# EAGLE design rf231con (EAGLE 6.5.0)
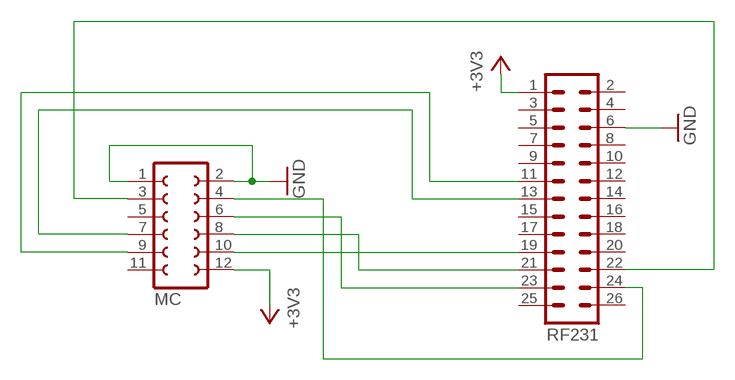
[diagram p0: schematic, sheet 1]

## Parts
MC  FE06-2  [FE06-2]
RF231  MA13-2  [MA13-2]

## Nets
+3V3: MC.12 RF231.1
GND: MC.1 MC.2 RF231.6
N$1: MC.4 RF231.24
N$2: MC.6 RF231.23
N$3: MC.8 RF231.21
N$4: MC.10 RF231.19
N$5: MC.9 RF231.11
N$6: MC.7 RF231.13
N$7: MC.3 RF231.22
Unconnected: MC.5 MC.11 RF231.2 RF231.3 RF231.4 RF231.5 RF231.7 RF231.8 RF231.9 RF231.10 RF231.12 RF231.14 RF231.15 RF231.16 RF231.17 RF231.18 RF231.20 RF231.25 RF231.26

## Library data of the parts
MC = con-lsta:FE06-2: FEMALE HEADER; OC_FARNELL: unknown; OC_NEWARK: unknown
RF231 = con-lstb:MA13-2: PIN HEADER; OC_FARNELL: unknown; OC_NEWARK: unknown

## Board
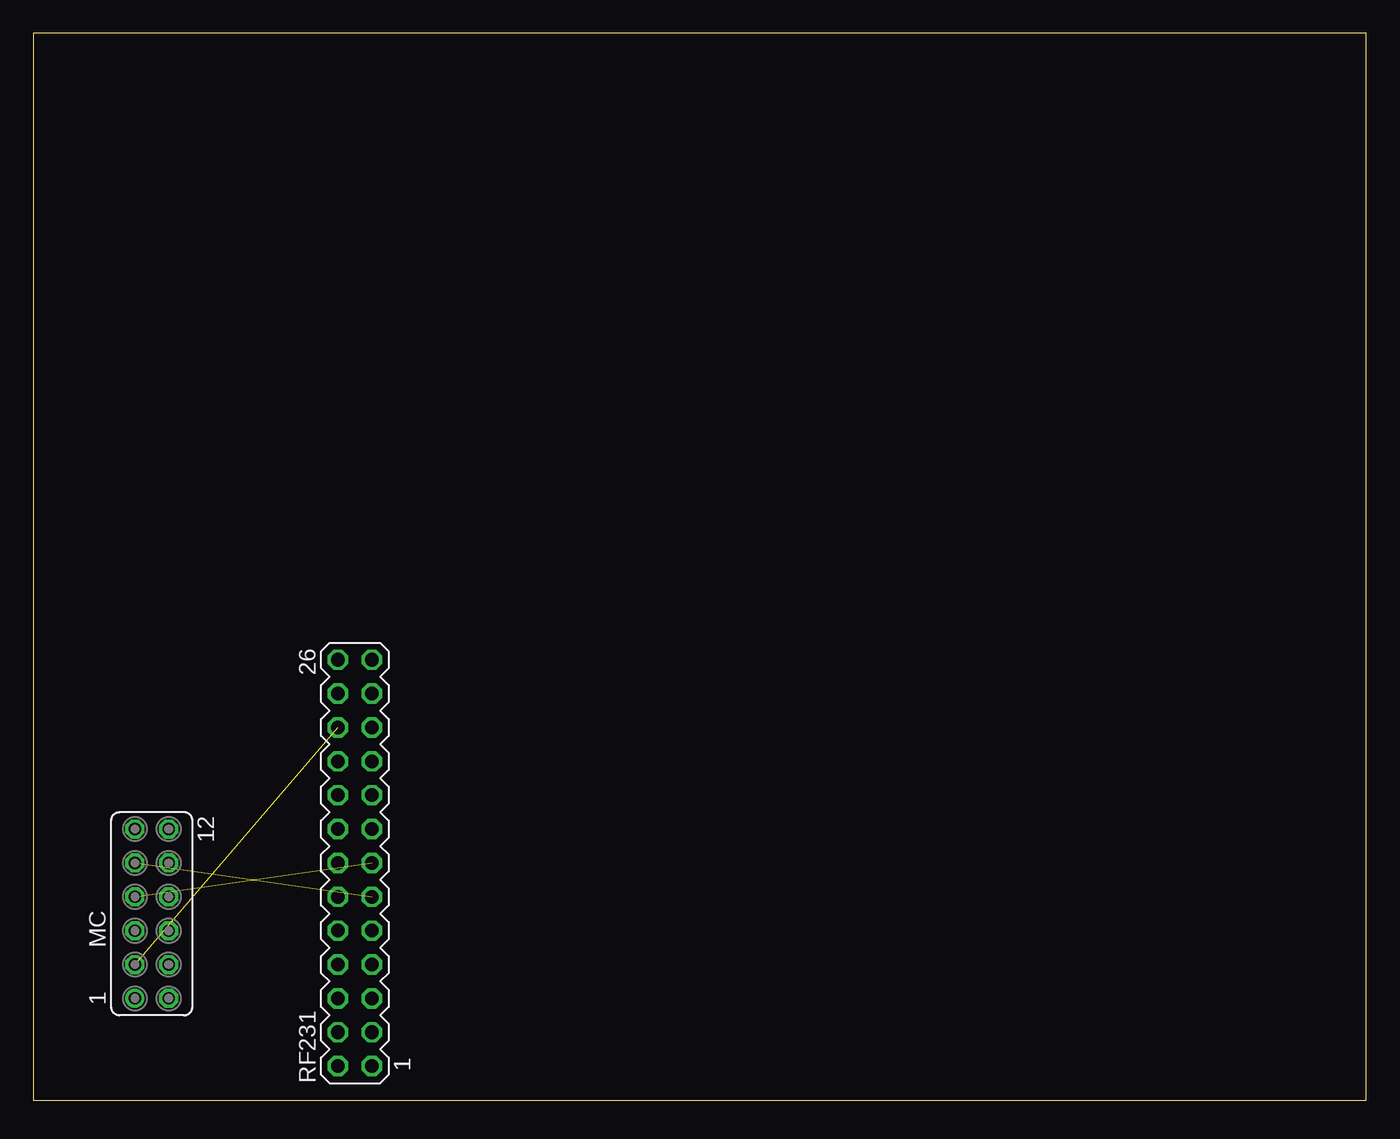
[diagram p1: board, top side]
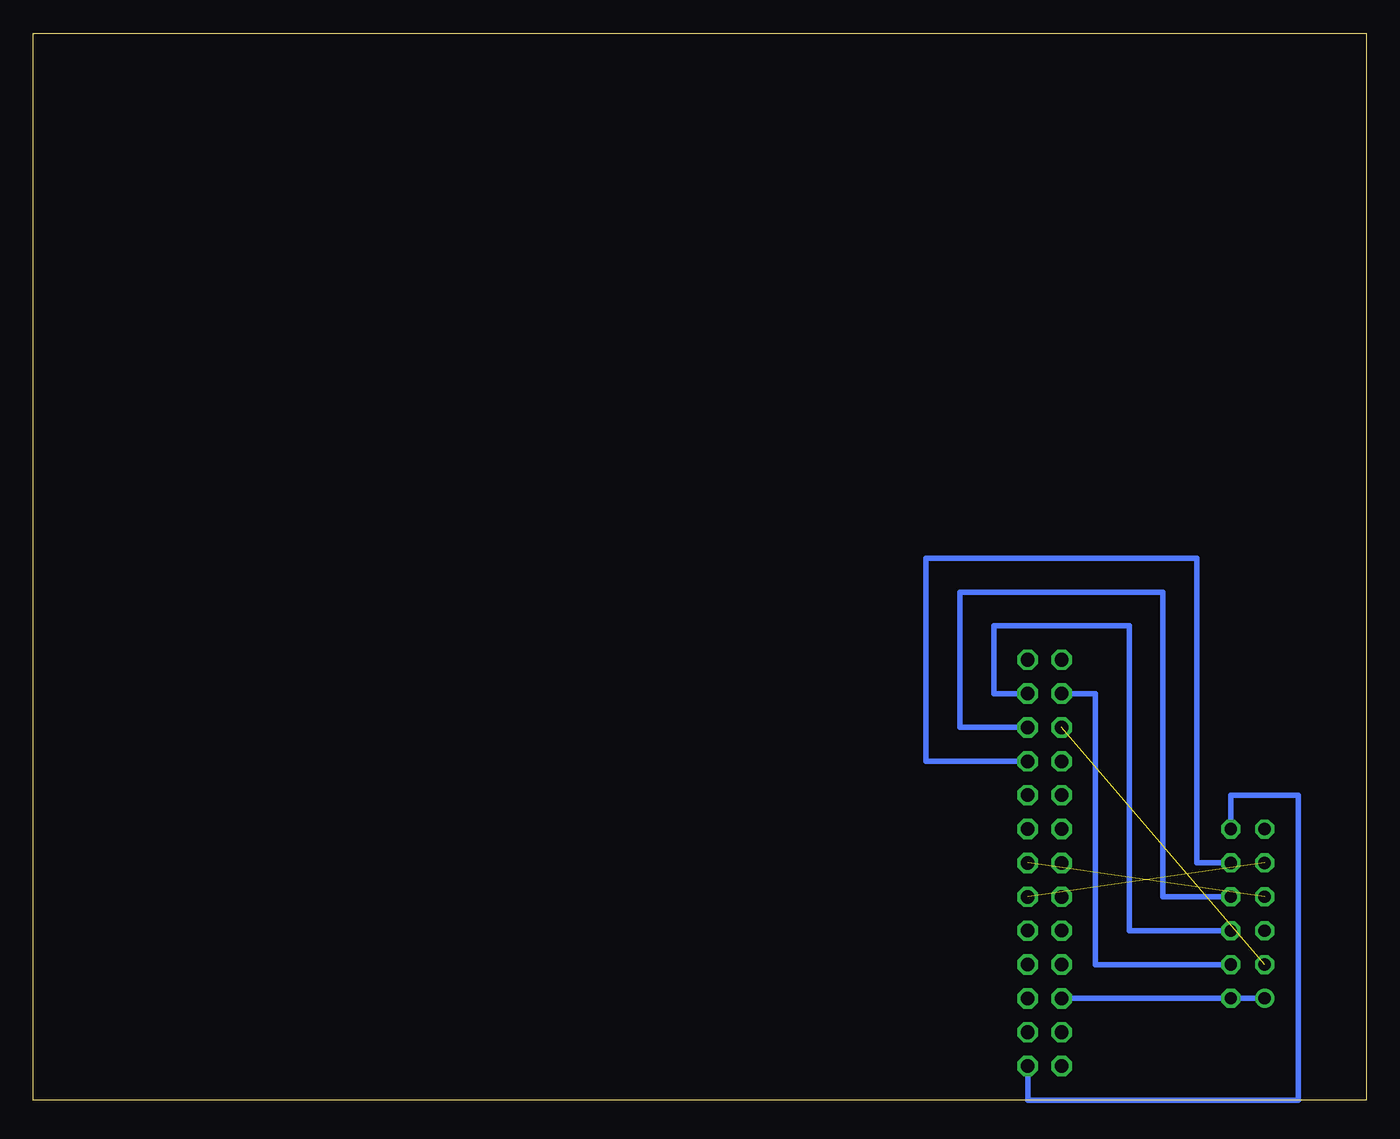
[diagram p2: board, bottom side, seen from below]

Size 100 x 80 mm. Coordinates in mm from the lower left corner, seen from the top.
Outline: 0,0 100,0 100,80 0,80 0,0
Copper layers (1*16): Top 0.035mm / dielectric 1.5mm / Bottom 0.035mm
Design rules "default": minimum track width 10mil, minimum drill 24mil, track to track 8mil, track to pad 8mil, pad to pad 8mil, via to via 8mil, smd to smd 8mil, copper to edge 40mil, drill to drill 8mil, minimum pad ring 10mil, minimum via ring 8mil, stop-mask expansion 4mil, vias tented up to drill 0mil, thermal gap 10mil

### Footprints (pad centres in the part's own frame; a part is rotated, then mirrored left to right if it is on the bottom)
FE06-2 = drill 0.914: 1 -6.35,1.27 | drill 0.914 octagon: 2 -6.35,-1.27; 3 -3.81,1.27; 4 -3.81,-1.27; 5 -1.27,1.27; 6 -1.27,-1.27; 7 1.27,1.27; 8 1.27,-1.27; 9 3.81,1.27; 10 3.81,-1.27; 11 6.35,1.27; 12 6.35,-1.27
MA13-2 = drill 1.016 octagon: 1 -15.24,-1.27; 2 -15.24,1.27; 3 -12.7,-1.27; 4 -12.7,1.27; 5 -10.16,-1.27; 6 -10.16,1.27; 7 -7.62,-1.27; 8 -7.62,1.27; 9 -5.08,-1.27; 10 -5.08,1.27; 11 -2.54,-1.27; 12 -2.54,1.27; 13 0,-1.27; 14 0,1.27; 15 2.54,-1.27; 16 2.54,1.27; 17 5.08,-1.27; 18 5.08,1.27; 19 7.62,-1.27; 20 7.62,1.27; 21 10.16,-1.27; 22 10.16,1.27; 23 12.7,-1.27; 24 12.7,1.27; 25 15.24,-1.27; 26 15.24,1.27

### Placement (x,y rotation side)
MC  8.89,13.97 90 top
RF231  24.13,17.78 90 top

### Tracks (layer width: path | path; a pad name or v marks a point on that pad's centre or on a via)
+3V3
  Bottom 0.406: MC.12 10.16,22.86 5.08,22.86 5.08,0 25.4,0 RF231.1
GND
  Bottom 0.406: MC.1 MC.2 RF231.6
N$1
  Bottom 0.406: MC.4 20.32,10.16 20.32,30.48 RF231.24
N$2
  Bottom 0.406: MC.6 17.78,12.7 17.78,35.56 27.94,35.56 27.94,30.48 RF231.23
N$3
  Bottom 0.406: RF231.21 30.48,27.94 30.48,38.1 15.24,38.1 15.24,15.24 MC.8
N$4
  Bottom 0.406: RF231.19 33.02,25.4 33.02,40.64 12.7,40.64 12.7,17.78 MC.10
N$5  (1 unrouted)
N$6  (1 unrouted)
N$7  (1 unrouted)